# EAGLE design Module-Extension_V101 (EAGLE 6.4)

## Sheet 1 of 2
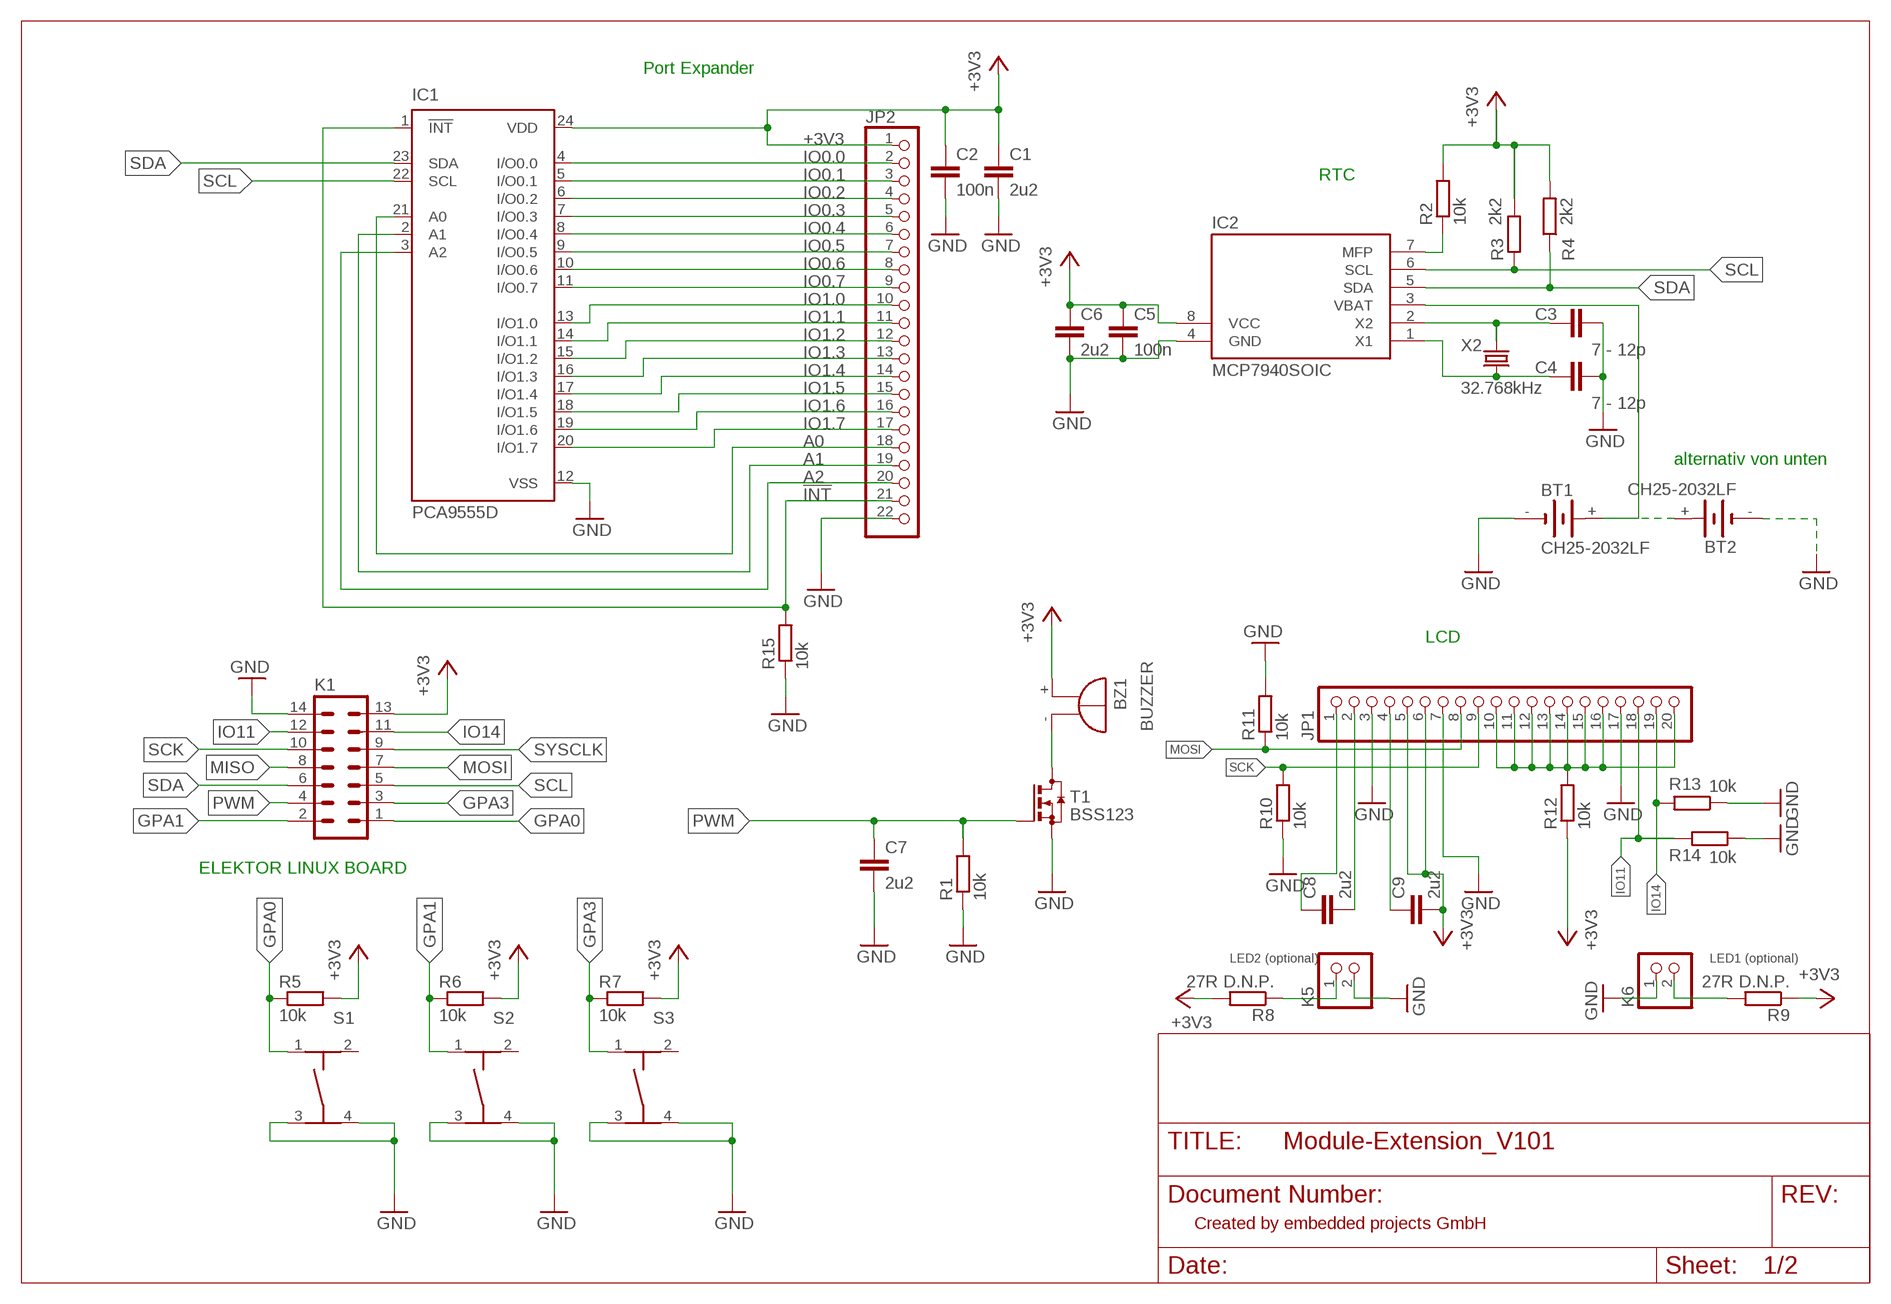
[diagram p0: schematic, sheet 1]

### Parts
BT1  CH25-2032LF  [CH25]
BT2  CH25-2032LF  [CH25]
BZ1  BUZZER  F/TMB  [F/TMB]
C1  2u2  C-EUC0805  [C0805]
C2  100n  C-EUC0805  [C0805]
C3  7 - 12p  C-EUC0805  [C0805]
C4  7 - 12p  C-EUC0805  [C0805]
C5  100n  C-EUC0805  [C0805]
C6  2u2  C-EUC0805  [C0805]
C7  2u2  C-EUC0805  [C0805]
C8  2u2  C-EUC0805  [C0805]
C9  2u2  C-EUC0805  [C0805]
IC1  PCA9555D  [SO24]
IC2  MCP7940SOIC  [SOIC-8]
JP1  PINHD-1X20  [1X20]
JP2  PINHD-1X22  [1X22]
K1  ML14  [ML14]
K5  PINHD-1X2  [1X02]
K6  PINHD-1X2  [1X02]
R1  10k  R-EU_R0805  [R0805]
R2  10k  R-EU_R0805  [R0805]
R3  2k2  R-EU_R0805  [R0805]
R4  2k2  R-EU_R0805  [R0805]
R5  10k  R-EU_R0805  [R0805]
R6  10k  R-EU_R0805  [R0805]
R7  10k  R-EU_R0805  [R0805]
R8  27R D.N.P.  R-EU_R0805  [R0805]
R9  27R D.N.P.  R-EU_R0805  [R0805]
R10  10k  R-EU_R0805  [R0805]
R11  10k  R-EU_R0805  [R0805]
R12  10k  R-EU_R0805  [R0805]
R13  10k  R-EU_R0805  [R0805]
R14  10k  R-EU_R0805  [R0805]
R15  10k  R-EU_R0805  [R0805]
S1  ERGAENZUNG_TASTER-9314_SMD  [ERGAENZUNG_TASTER-9314_SMD]
S2  ERGAENZUNG_TASTER-9314_SMD  [ERGAENZUNG_TASTER-9314_SMD]
S3  ERGAENZUNG_TASTER-9314_SMD  [ERGAENZUNG_TASTER-9314_SMD]
T1  BSS123  [SOT23]
X2  32.768kHz  CRYSTALTC26H  [TC26H]

### Nets
!INT: IC1.1(!INT) JP2.21 R15.2
+3V3: BZ1.+ C1.1 C2.1 C5.1 C6.1 C9.2 IC1.24(VDD) IC2.8(VCC) JP1.5 JP1.6 JP2.1 K1.13 R2.2 R3.2 R4.2 R5.2 R6.2 R7.2 R8.2 R9.1 R12.1 ; also sheet 2
A0: IC1.21(A0) JP2.18
A1: IC1.2(A1) JP2.19
A2: IC1.3(A2) JP2.20
GND: BT1.- BT2.- C1.2 C2.2 C3.2 C4.2 C5.2 C6.2 C7.2 IC1.12(VSS) IC2.4(GND) JP1.3 JP1.7 JP1.17 JP2.22 K1.14 K5.2 K6.1 R1.1 R10.1 R11.2 R13.1 R14.1 R15.1 S1.3 S1.4 S2.3 S2.4 S3.3 S3.4 T1.2(S) ; also sheet 2
GPA0: K1.1 R5.1 S1.1
GPA1: K1.2 R6.1 S2.1
GPA3: K1.3 R7.1 S3.1
IO0.0: IC1.4(I/O0.0) JP2.2
IO0.1: IC1.5(I/O0.1) JP2.3
IO0.2: IC1.6(I/O0.2) JP2.4
IO0.3: IC1.7(I/O0.3) JP2.5
IO0.4: IC1.8(I/O0.4) JP2.6
IO0.5: IC1.9(I/O0.5) JP2.7
IO0.6: IC1.10(I/O0.6) JP2.8
IO0.7: IC1.11(I/O0.7) JP2.9
IO1.0: IC1.13(I/O1.0) JP2.10
IO1.1: IC1.14(I/O1.1) JP2.11
IO1.2: IC1.15(I/O1.2) JP2.12
IO1.3: IC1.16(I/O1.3) JP2.13
IO1.4: IC1.17(I/O1.4) JP2.14
IO1.5: IC1.18(I/O1.5) JP2.15
IO1.6: IC1.19(I/O1.6) JP2.16
IO1.7: IC1.20(I/O1.7) JP2.17
IO11: JP1.18 K1.12 R14.2
IO14: JP1.19 K1.11 R13.2
MISO: K1.8
MOSI: JP1.8 K1.7 R11.1
N$1: C8.1 JP1.1
N$2: BZ1.- T1.3(D)
N$3: IC2.7(MFP) R2.1
N$4: C3.1 IC2.2(X2) X2.1
N$5: C8.2 JP1.2
N$6: C9.1 JP1.4
N$7: K5.1 R8.1
N$8: K6.2 R9.2
N$9: JP1.10 JP1.11 JP1.12 JP1.13 JP1.14 JP1.15 JP1.16 JP1.20 R12.2
N$11: C4.1 IC2.1(X1) X2.2
PWM: C7.1 K1.4 R1.2 T1.1(G)
SCK: JP1.9 K1.10 R10.2
SCL: IC1.22(SCL) IC2.6(SCL) K1.5 R3.1
SDA: IC1.23(SDA) IC2.5(SDA) K1.6 R4.1
SYSCLK: K1.9
VBAT: BT1.+ BT2.+ IC2.3(VBAT)
Unconnected: S1.2 S2.2 S3.2

### Notes on the sheet
- Port Expander
- RTC
- alternativ von unten
- LCD
- ELEKTOR LINUX BOARD
- LED2 (optional) | LED1 (optional)
- Created by embedded projects GmbH

## Sheet 2 of 2
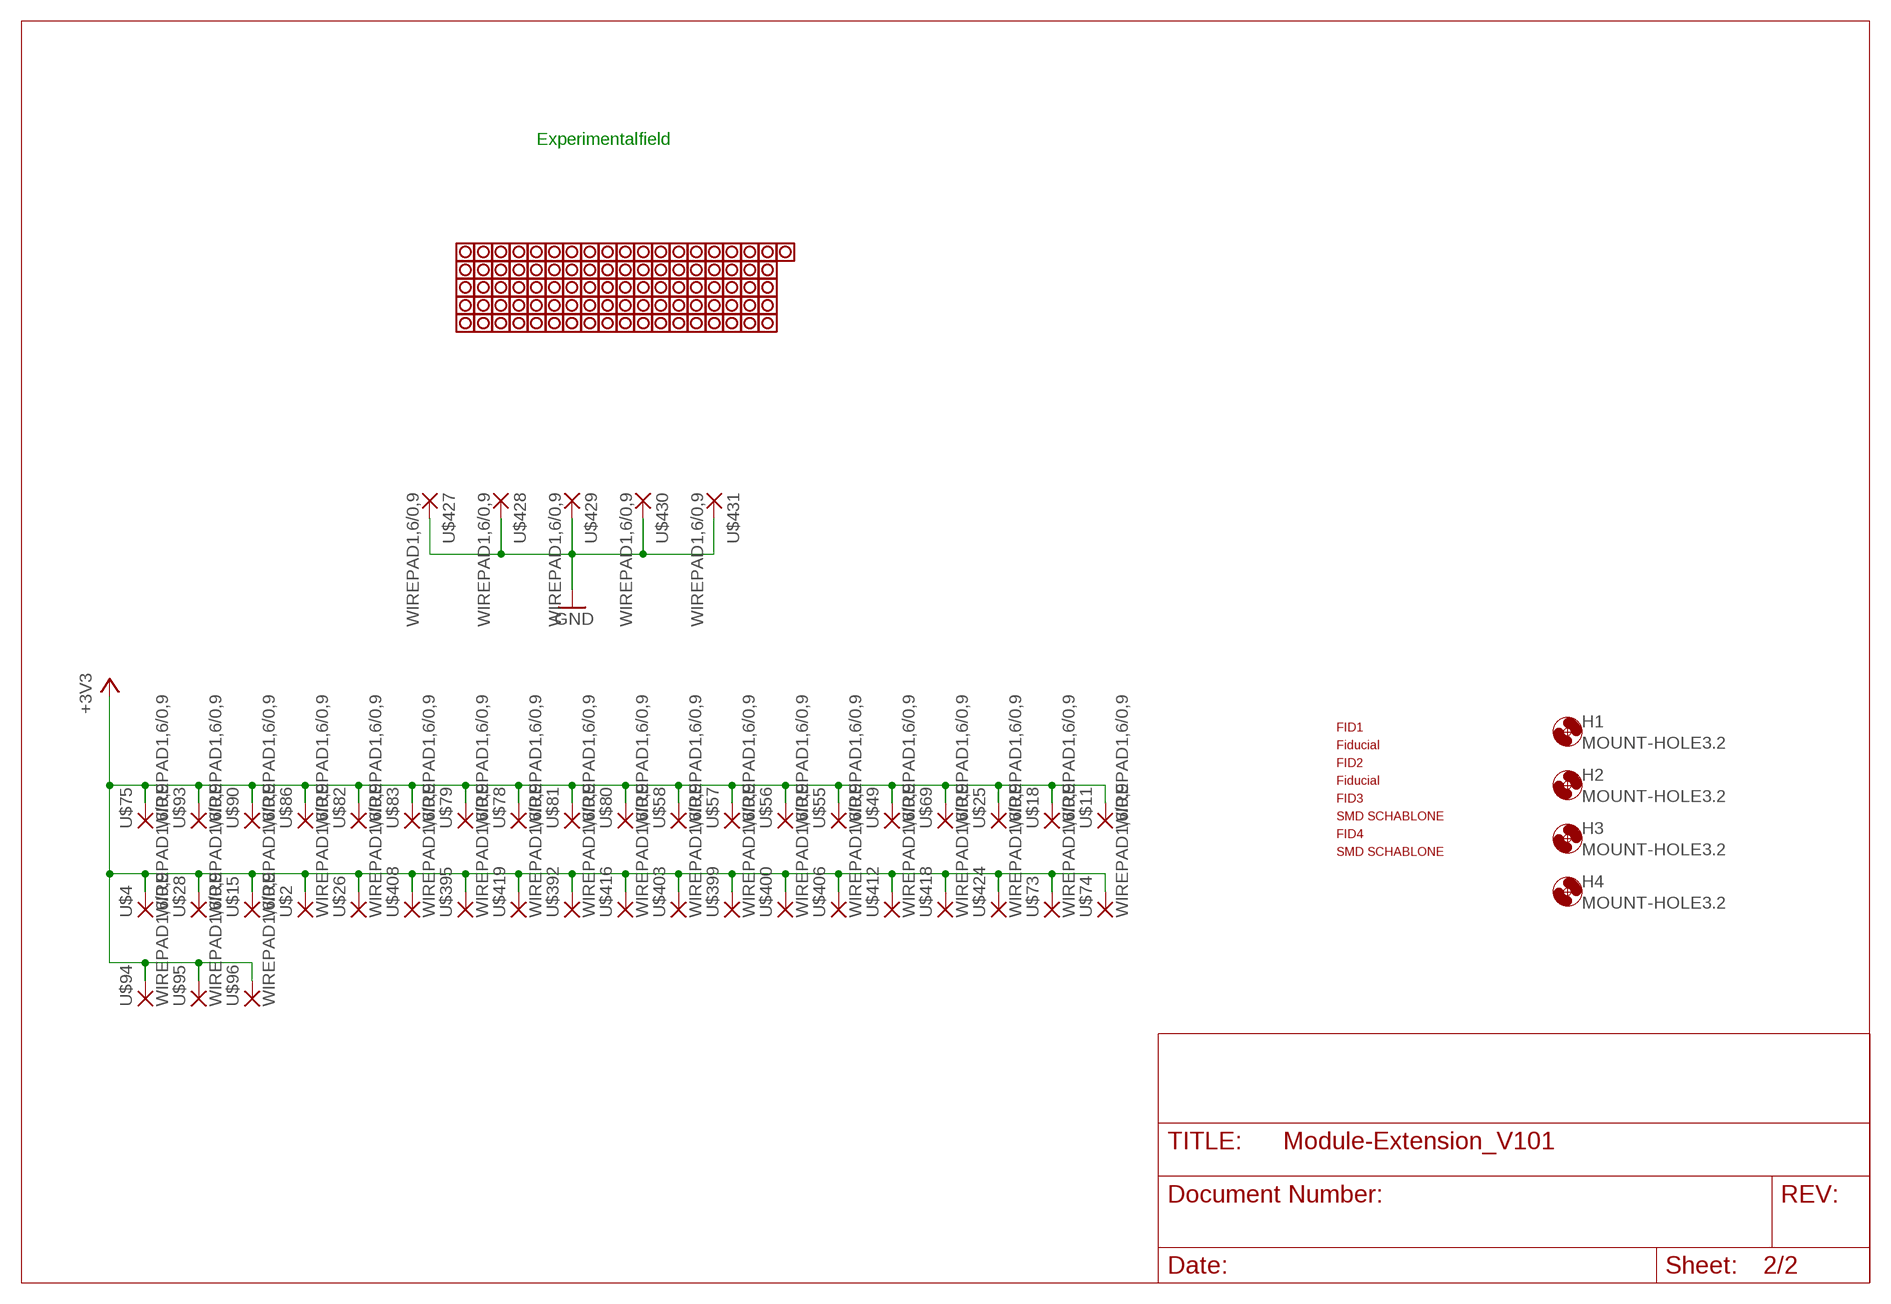
[diagram p1: schematic, sheet 2]

### Parts
FID1  PASSERMARKEN_FIDUCIAL  [PASSERMARKEN_FIDUCIAL]
FID2  PASSERMARKEN_FIDUCIAL  [PASSERMARKEN_FIDUCIAL]
FID3  PASSERMARKEN_FIDUCIAL  [PASSERMARKEN_FIDUCIAL]
FID4  PASSERMARKEN_FIDUCIAL  [PASSERMARKEN_FIDUCIAL]
H1  MOUNT-HOLE3.2  [3,2]
H2  MOUNT-HOLE3.2  [3,2]
H3  MOUNT-HOLE3.2  [3,2]
H4  MOUNT-HOLE3.2  [3,2]
U$2  WIREPAD1,6/0,9  [1,6/0,9]
U$3  VIAS  [VIAS]
U$4  WIREPAD1,6/0,9  [1,6/0,9]
U$5  VIAS  [VIAS]
U$6  VIAS  [VIAS]
U$7  VIAS  [VIAS]
U$8  VIAS  [VIAS]
U$9  VIAS  [VIAS]
U$10  VIAS  [VIAS]
U$11  WIREPAD1,6/0,9  [1,6/0,9]
U$12  VIAS  [VIAS]
U$13  VIAS  [VIAS]
U$14  VIAS  [VIAS]
U$15  WIREPAD1,6/0,9  [1,6/0,9]
U$16  VIAS  [VIAS]
U$17  VIAS  [VIAS]
U$18  WIREPAD1,6/0,9  [1,6/0,9]
U$19  VIAS  [VIAS]
U$20  VIAS  [VIAS]
U$21  VIAS  [VIAS]
U$22  VIAS  [VIAS]
U$23  VIAS  [VIAS]
U$24  VIAS  [VIAS]
U$25  WIREPAD1,6/0,9  [1,6/0,9]
U$26  WIREPAD1,6/0,9  [1,6/0,9]
U$27  VIAS  [VIAS]
U$28  WIREPAD1,6/0,9  [1,6/0,9]
U$29  VIAS  [VIAS]
U$30  VIAS  [VIAS]
U$31  VIAS  [VIAS]
U$32  VIAS  [VIAS]
U$33  VIAS  [VIAS]
U$34  VIAS  [VIAS]
U$35  VIAS  [VIAS]
U$36  VIAS  [VIAS]
U$37  VIAS  [VIAS]
U$38  VIAS  [VIAS]
U$39  VIAS  [VIAS]
U$40  VIAS  [VIAS]
U$41  VIAS  [VIAS]
U$42  VIAS  [VIAS]
U$43  VIAS  [VIAS]
U$44  VIAS  [VIAS]
U$45  VIAS  [VIAS]
U$46  VIAS  [VIAS]
U$47  VIAS  [VIAS]
U$48  VIAS  [VIAS]
U$49  WIREPAD1,6/0,9  [1,6/0,9]
U$50  VIAS  [VIAS]
U$51  VIAS  [VIAS]
U$52  VIAS  [VIAS]
U$53  VIAS  [VIAS]
U$54  VIAS  [VIAS]
U$55  WIREPAD1,6/0,9  [1,6/0,9]
U$56  WIREPAD1,6/0,9  [1,6/0,9]
U$57  WIREPAD1,6/0,9  [1,6/0,9]
U$58  WIREPAD1,6/0,9  [1,6/0,9]
U$59  VIAS  [VIAS]
U$60  VIAS  [VIAS]
U$61  VIAS  [VIAS]
U$62  VIAS  [VIAS]
U$63  VIAS  [VIAS]
U$64  VIAS  [VIAS]
U$65  VIAS  [VIAS]
U$66  VIAS  [VIAS]
U$67  VIAS  [VIAS]
U$68  VIAS  [VIAS]
U$69  WIREPAD1,6/0,9  [1,6/0,9]
U$70  VIAS  [VIAS]
U$71  VIAS  [VIAS]
U$72  VIAS  [VIAS]
U$73  WIREPAD1,6/0,9  [1,6/0,9]
U$74  WIREPAD1,6/0,9  [1,6/0,9]
U$75  WIREPAD1,6/0,9  [1,6/0,9]
U$76  VIAS  [VIAS]
U$77  VIAS  [VIAS]
U$78  WIREPAD1,6/0,9  [1,6/0,9]
U$79  WIREPAD1,6/0,9  [1,6/0,9]
U$80  WIREPAD1,6/0,9  [1,6/0,9]
U$81  WIREPAD1,6/0,9  [1,6/0,9]
U$82  WIREPAD1,6/0,9  [1,6/0,9]
U$83  WIREPAD1,6/0,9  [1,6/0,9]
U$84  VIAS  [VIAS]
U$85  VIAS  [VIAS]
U$86  WIREPAD1,6/0,9  [1,6/0,9]
U$87  VIAS  [VIAS]
U$88  VIAS  [VIAS]
U$89  VIAS  [VIAS]
U$90  WIREPAD1,6/0,9  [1,6/0,9]
U$91  VIAS  [VIAS]
U$92  VIAS  [VIAS]
U$93  WIREPAD1,6/0,9  [1,6/0,9]
U$94  WIREPAD1,6/0,9  [1,6/0,9]
U$95  WIREPAD1,6/0,9  [1,6/0,9]
U$96  WIREPAD1,6/0,9  [1,6/0,9]
U$391  VIAS  [VIAS]
U$392  WIREPAD1,6/0,9  [1,6/0,9]
U$393  VIAS  [VIAS]
U$394  VIAS  [VIAS]
U$395  WIREPAD1,6/0,9  [1,6/0,9]
U$396  VIAS  [VIAS]
U$397  VIAS  [VIAS]
U$398  VIAS  [VIAS]
U$399  WIREPAD1,6/0,9  [1,6/0,9]
U$400  WIREPAD1,6/0,9  [1,6/0,9]
U$401  VIAS  [VIAS]
U$402  VIAS  [VIAS]
U$403  WIREPAD1,6/0,9  [1,6/0,9]
U$404  VIAS  [VIAS]
U$405  VIAS  [VIAS]
U$406  WIREPAD1,6/0,9  [1,6/0,9]
U$407  VIAS  [VIAS]
U$408  WIREPAD1,6/0,9  [1,6/0,9]
U$409  VIAS  [VIAS]
U$410  VIAS  [VIAS]
U$411  VIAS  [VIAS]
U$412  WIREPAD1,6/0,9  [1,6/0,9]
U$413  VIAS  [VIAS]
U$414  VIAS  [VIAS]
U$415  VIAS  [VIAS]
U$416  WIREPAD1,6/0,9  [1,6/0,9]
U$417  VIAS  [VIAS]
U$418  WIREPAD1,6/0,9  [1,6/0,9]
U$419  WIREPAD1,6/0,9  [1,6/0,9]
U$420  VIAS  [VIAS]
U$421  VIAS  [VIAS]
U$422  VIAS  [VIAS]
U$423  VIAS  [VIAS]
U$424  WIREPAD1,6/0,9  [1,6/0,9]
U$425  VIAS  [VIAS]
U$426  VIAS  [VIAS]
U$427  WIREPAD1,6/0,9  [1,6/0,9]
U$428  WIREPAD1,6/0,9  [1,6/0,9]
U$429  WIREPAD1,6/0,9  [1,6/0,9]
U$430  WIREPAD1,6/0,9  [1,6/0,9]
U$431  WIREPAD1,6/0,9  [1,6/0,9]
U$432  VIAS  [VIAS]

### Nets
+3V3: U$2.1(P) U$4.1(P) U$11.1(P) U$15.1(P) U$18.1(P) U$25.1(P) U$26.1(P) U$28.1(P) U$49.1(P) U$55.1(P) U$56.1(P) U$57.1(P) U$58.1(P) U$69.1(P) U$73.1(P) U$74.1(P) U$75.1(P) U$78.1(P) U$79.1(P) U$80.1(P) U$81.1(P) U$82.1(P) U$83.1(P) U$86.1(P) U$90.1(P) U$93.1(P) U$94.1(P) U$95.1(P) U$96.1(P) U$392.1(P) U$395.1(P) U$399.1(P) U$400.1(P) U$403.1(P) U$406.1(P) U$408.1(P) U$412.1(P) U$416.1(P) U$418.1(P) U$419.1(P) U$424.1(P) ; also sheet 1
GND: U$427.1(P) U$428.1(P) U$429.1(P) U$430.1(P) U$431.1(P) ; also sheet 1

### Notes on the sheet
- Experimentalfield

## Library data of the parts
BT1 BT2 = Batteriehalter:CH25-2032LF; FARNELL: 2064715
BZ1 = buzzer:F/TMB: BUZZER Source: Buerklin; OC_FARNELL: unknown; OC_NEWARK: unknown
C1-C9 = rcl:C-EU: CAPACITOR, European symbol
FID1 FID2 = KUBUS3:PASSERMARKEN_FIDUCIAL: SMD Passermarke
FID3 FID4 = SMDSCHABLONE:PASSERMARKEN_FIDUCIAL: SMD Passermarke
H1-H4 = holes:MOUNT-HOLE: MOUNTING HOLE with drill center marker
IC1 = micro-philips:PCA9555: 16-bit I2C and SMBus I/O port with interrupt Source: PCA9555_5.pdf; MPN: PCA9555DW; OC_FARNELL: 8906076; OC_NEWARK: 63K6067
IC2 = mcp7940:MCP7940: I²C Real-Time Clock/Calendar
JP1 = pinhead:PINHD-1X20: PIN HEADER
JP2 = pinhead:PINHD-1X22: PIN HEADER
K1 = con-ml:ML14: HARTING; OC_FARNELL: unknown; OC_NEWARK: unknown
K5 K6 = pinhead:PINHD-1X2: PIN HEADER
R1-R15 = rcl:R-EU_: RESISTOR, European symbol
S1-S3 = OPENKUBUSRTC:ERGAENZUNG_TASTER-9314_SMD
T1 = transistor-small-signal:BSS123: N-CHANNEL MOS FET
U$2 U$4 U$11 U$15 U$18 U$25 U$26 U$28 U$49 U$55-U$58 U$69 U$73-U$75 U$78-U$83 U$86 U$90 U$93-U$96 U$392 U$395 U$399 U$400 U$403 U$406 U$408 U$412 U$416 U$418 U$419 U$424 U$427-U$431 = wirepad:WIREPAD: Wire PAD connect wire on PCB
U$3 U$5-U$10 U$12-U$14 U$16 U$17 U$19-U$24 U$27 U$29-U$48 U$50-U$54 U$59-U$68 U$70-U$72 U$76 U$77 U$84 U$85 U$87-U$89 U$91 U$92 U$391 U$393 U$394 U$396-U$398 U$401 U$402 U$404 U$405 U$407 U$409-U$411 U$413-U$415 U$417 U$420-U$423 U$425 U$426 U$432 = VIAS:VIAS
X2 = crystal:CRYSTAL: CRYSTAL; OC_FARNELL: unknown; OC_NEWARK: unknown

## Board
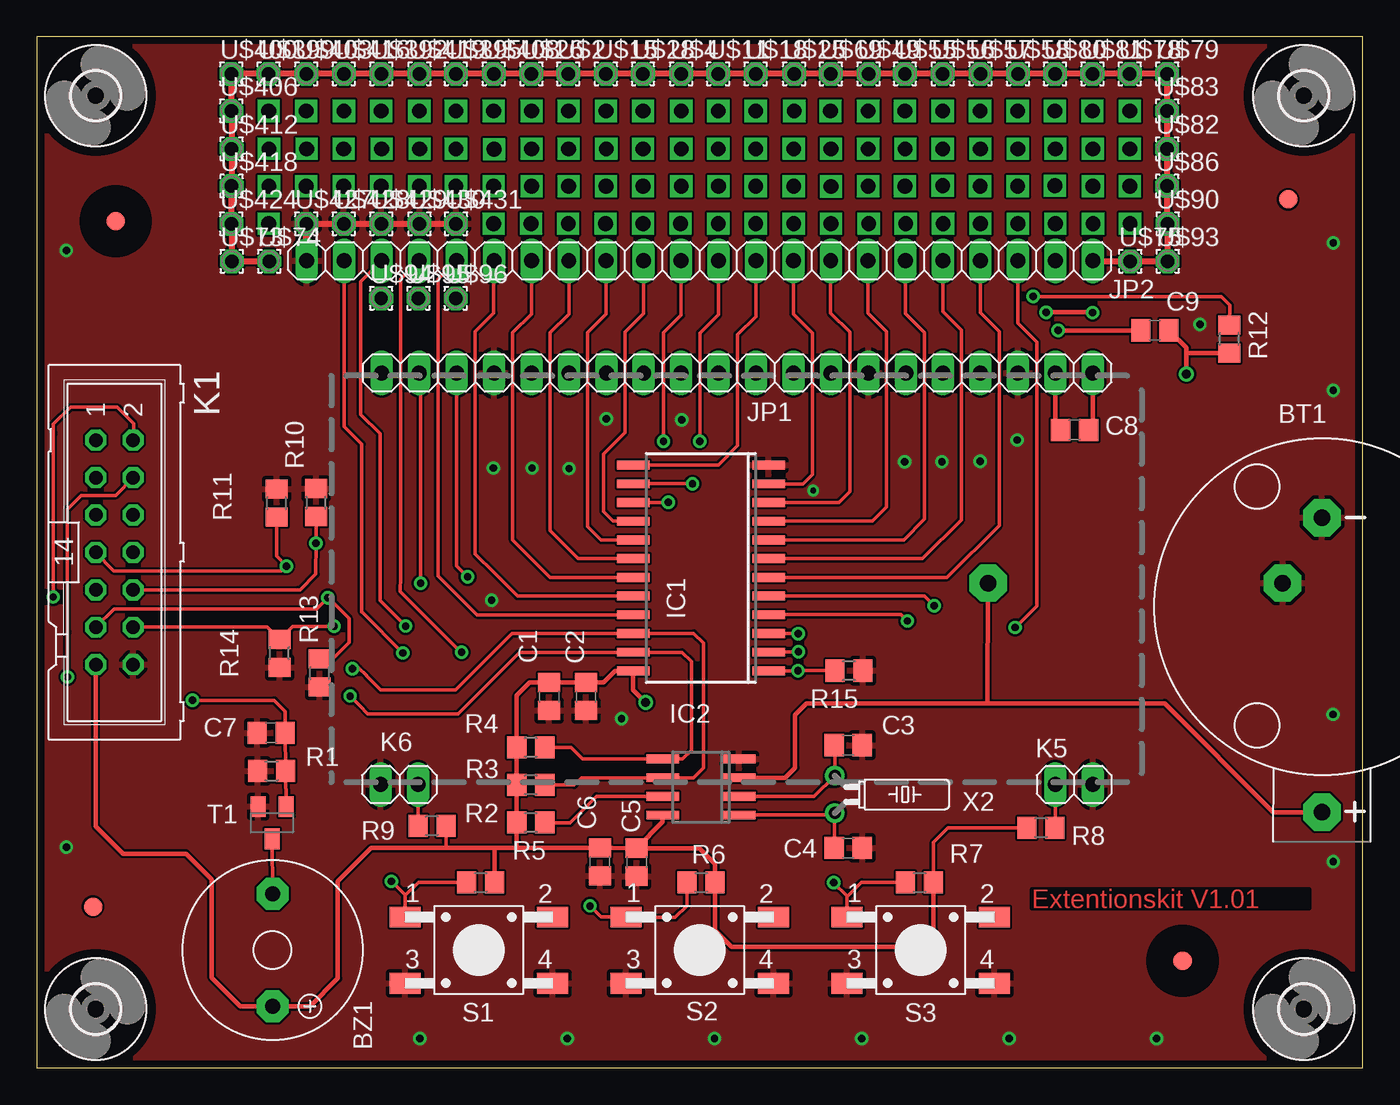
[diagram p2: board, top side]
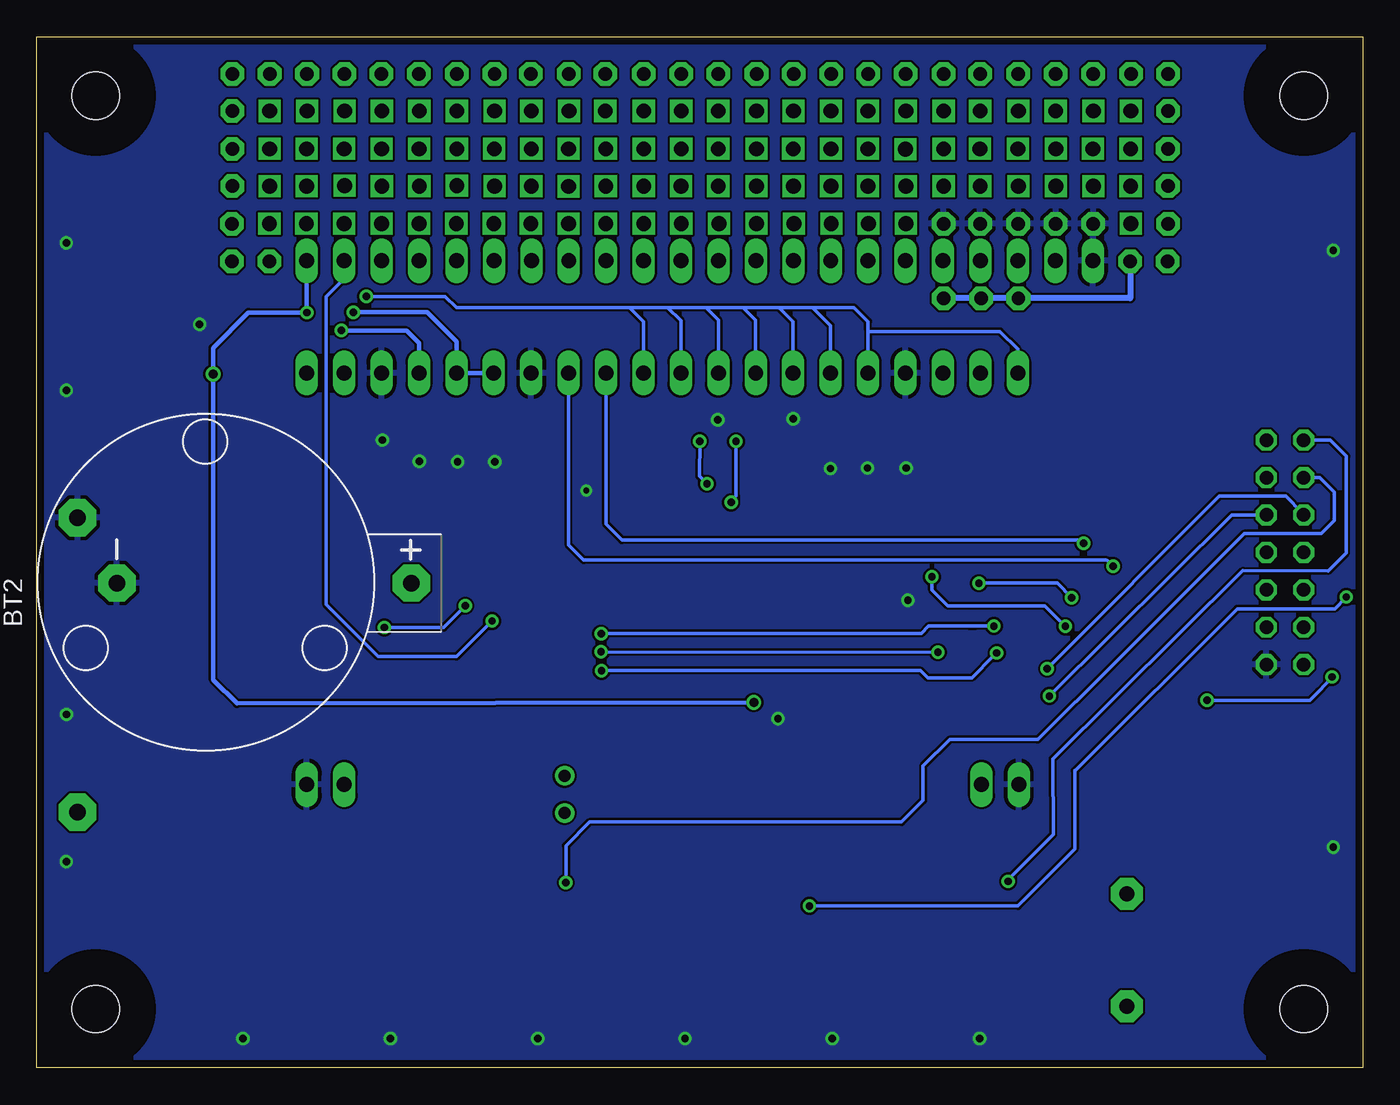
[diagram p3: board, bottom side, seen from below]

Size 90 x 70 mm. Coordinates in mm from the lower left corner, seen from the top.
Outline: 0,0 90,0 90,70 0,70 0,0
Copper layers (1*16): Top 0.035mm / dielectric 1.5mm / Bottom 0.035mm
Design rules "default *": minimum track width 6mil, minimum drill 20mil, track to track 6mil, track to pad 6mil, pad to pad 8mil, via to via 8mil, smd to smd 8mil, copper to edge 20mil, drill to drill 8mil, minimum pad ring 10mil, minimum via ring 8mil, stop-mask expansion 2mil, vias tented up to drill 40mil, thermal gap 10mil

### Footprints (pad centres in the part's own frame; a part is rotated, then mirrored left to right if it is on the bottom)
CH25 = drill 1.118 pad 2.54 octagon: + 0,-14; - 0,6
F/TMB = drill 1.016 pad 2.159 octagon: + 3.81,0; - -3.81,0
C0805 = smd 1.3 x 1.5: 1 -0.95,0; 2 0.95,0
PASSERMARKEN_FIDUCIAL = smd 1.27 x 1.27: 1 0,0
3,2 = hole 3.2: 0,0
SO24 = smd 0.6 x 2.2: 1 -6.985,-4.6; 2 -5.715,-4.6; 3 -4.445,-4.6; 4 -3.175,-4.6; 5 -1.905,-4.6; 6 -0.635,-4.6; 7 0.635,-4.6; 8 1.905,-4.6; 9 3.175,-4.6; 10 4.445,-4.6; 11 5.715,-4.6; 12 6.985,-4.6; 13 6.985,4.6; 14 5.715,4.6; 15 4.445,4.6; 16 3.175,4.6; 17 1.905,4.6; 18 0.635,4.6; 19 -0.635,4.6; 20 -1.905,4.6; 21 -3.175,4.6; 22 -4.445,4.6; 23 -5.715,4.6; 24 -6.985,4.6
SOIC-8 = smd 0.6 x 2.2: 1 -1.905,-2.6; 2 -0.635,-2.6; 3 0.635,-2.6; 4 1.905,-2.6; 5 1.905,2.6; 6 0.635,2.6; 7 -0.635,2.6; 8 -1.905,2.6
1X20 = drill 1.016 long: 1 -24.13,0; 2 -21.59,0; 3 -19.05,0; 4 -16.51,0; 5 -13.97,0; 6 -11.43,0; 7 -8.89,0; 8 -6.35,0; 9 -3.81,0; 10 -1.27,0; 11 1.27,0; 12 3.81,0; 13 6.35,0; 14 8.89,0; 15 11.43,0; 16 13.97,0; 17 16.51,0; 18 19.05,0; 19 21.59,0; 20 24.13,0
1X22 = drill 1.016 long: 1 -26.67,0; 2 -24.13,0; 3 -21.59,0; 4 -19.05,0; 5 -16.51,0; 6 -13.97,0; 7 -11.43,0; 8 -8.89,0; 9 -6.35,0; 10 -3.81,0; 11 -1.27,0; 12 1.27,0; 13 3.81,0; 14 6.35,0; 15 8.89,0; 16 11.43,0; 17 13.97,0; 18 16.51,0; 19 19.05,0; 20 21.59,0; 21 24.13,0; 22 26.67,0
ML14 = drill 0.914 octagon: 1 -7.62,-1.27; 2 -7.62,1.27; 3 -5.08,-1.27; 4 -5.08,1.27; 5 -2.54,-1.27; 6 -2.54,1.27; 7 0,-1.27; 8 0,1.27; 9 2.54,-1.27; 10 2.54,1.27; 11 5.08,-1.27; 12 5.08,1.27; 13 7.62,-1.27; 14 7.62,1.27
1X02 = drill 1.016 long: 1 -1.27,0; 2 1.27,0
R0805 = smd 1.3 x 1.5: 1 -0.95,0; 2 0.95,0
ERGAENZUNG_TASTER-9314_SMD = smd 2.1 x 1.4: 1 -5,2.25; 2 5,2.25; 3 -5,-2.25; 4 5,-2.25
SOT23 = smd 1 x 1.4: 1 -0.95,-1.1; 2 0.95,-1.1; 3 0,1.1
1,6/0,9 = drill 0.914 pad 1.6 octagon: 1 0,0
VIAS = drill 1 square: P$1 0,0
TC26H = drill 0.813: 1 -1.27,0; 2 1.27,0

### Placement (x,y rotation side)
BT1  87.23,31.36 0 top
BT2  78.57,32.92 90 bottom
BZ1  16,8 270 top
C1  34.78,25.21 270 top
C2  37.28,25.21 270 top
C3  55.08,21.91 0 top
C4  55.08,14.93 0 top
C5  40.71,13.97 270 top
C6  38.22,13.99 270 top
C7  15.9,22.75 180 top
C8  70.45,43.31 180 top
C9  75.89,50.07 0 top
FID1  77.77,7.28 0 top
FID2  5.35,57.5 270 top
FID3  3.82,10.95 0 top
FID4  84.95,58.97 0 top
H1  4,66 0 top
H2  4,4 0 top
H3  86,66 0 top
H4  86,4 0 top
IC1  45.08,33.94 90 top
IC2  45.08,19.07 90 top
JP1  47.55,47.18 180 top
JP2  45,54.8 180 top
K1  5.27,35 270 top
K5  70.41,19.24 0 top
K6  24.61,19.24 0 top
R1  15.94,20.16 0 top
R2  33.53,16.66 180 top
R3  33.53,19.21 180 top
R4  33.53,21.76 180 top
R5  30.13,12.6 0 top
R6  45.09,12.6 0 top
R7  59.92,12.6 0 top
R8  68.16,16.3 180 top
R9  26.82,16.44 180 top
R10  18.95,38.38 270 top
R11  16.28,38.34 90 top
R12  80.95,49.49 90 top
R13  19.19,26.81 90 top
R14  16.47,28.15 90 top
R15  55.13,26.97 180 top
S1  30,8 0 top
S2  45,8 0 top
S3  60,8 0 top
T1  15.97,16.65 180 top
U$2  36.07,67.49 0 top
U$3  41.15,64.97 0 top
U$4  43.74,67.49 0 top
U$5  48.79,64.97 0 top
U$6  51.38,62.4 0 top
U$7  53.87,64.97 0 top
U$8  36.09,64.97 0 top
U$9  41.15,62.4 0 top
U$10  43.74,64.97 0 top
U$11  46.25,67.49 0 top
U$12  51.38,59.87 0 top
U$13  53.9,62.4 0 top
U$14  36.09,62.4 0 top
U$15  38.63,67.49 0 top
U$16  43.74,62.4 0 top
U$17  46.25,64.97 0 top
U$18  48.79,67.49 0 top
U$19  53.9,59.85 0 top
U$20  36.09,59.87 0 top
U$21  38.63,64.97 0 top
U$22  43.74,59.87 0 top
U$23  46.25,62.4 0 top
U$24  48.79,62.4 0 top
U$25  51.41,67.49 0 top
U$26  33.58,67.49 0 top
U$27  38.66,62.4 0 top
U$28  41.15,67.49 0 top
U$29  46.28,59.87 0 top
U$30  48.79,59.87 0 top
U$31  51.41,64.97 0 top
U$32  33.58,64.97 0 top
U$33  38.63,59.87 0 top
U$34  41.15,59.87 0 top
U$35  46.25,57.31 0 top
U$36  48.79,57.31 0 top
U$37  53.9,57.31 0 top
U$38  33.55,57.31 0 top
U$39  36.07,57.31 0 top
U$40  38.61,57.31 0 top
U$41  41.15,57.31 0 top
U$42  43.69,57.31 0 top
U$43  51.38,57.31 0 top
U$44  58.93,59.87 0 top
U$45  61.49,62.4 0 top
U$46  64.06,62.4 0 top
U$47  66.6,62.4 0 top
U$48  69.14,62.4 0 top
U$49  56.46,67.49 0 top
U$50  61.49,59.9 0 top
U$51  64.03,59.87 0 top
U$52  66.57,59.87 0 top
U$53  69.11,59.9 0 top
U$54  56.44,64.97 0 top
U$55  58.93,67.49 0 top
U$56  61.49,67.49 0 top
U$57  64.06,67.49 0 top
U$58  66.6,67.49 0 top
U$59  56.44,62.4 0 top
U$60  58.93,64.97 0 top
U$61  61.49,64.97 0 top
U$62  64.03,64.97 0 top
U$63  66.57,64.97 0 top
U$64  56.44,59.87 0 top
U$65  58.95,62.4 0 top
U$66  61.52,57.31 0 top
U$67  64.06,57.31 0 top
U$68  66.6,57.31 0 top
U$69  53.9,67.49 0 top
U$70  56.46,57.31 0 top
U$71  58.98,57.31 0 top
U$72  71.68,62.4 0 top
U$73  13.23,54.76 0 top
U$74  15.77,54.76 0 top
U$75  74.22,54.76 0 top
U$76  71.68,59.87 0 top
U$77  74.19,64.97 0 top
U$78  74.19,67.49 0 top
U$79  76.73,67.49 0 top
U$80  69.11,67.49 0 top
U$81  71.65,67.49 0 top
U$82  76.73,62.4 0 top
U$83  76.73,64.97 0 top
U$84  69.11,64.97 0 top
U$85  71.65,64.97 0 top
U$86  76.73,59.87 0 top
U$87  74.19,62.4 0 top
U$88  71.7,57.31 0 top
U$89  74.22,57.31 0 top
U$90  76.76,57.31 0 top
U$91  74.19,59.87 0 top
U$92  69.14,57.31 0 top
U$93  76.76,54.76 0 top
U$94  23.37,52.25 0 top
U$95  25.91,52.25 0 top
U$96  28.44,52.25 0 top
U$391  20.83,62.4 0 top
U$392  23.38,67.49 0 top
U$393  25.97,59.87 0 top
U$394  25.98,62.4 0 top
U$395  28.44,67.49 0 top
U$396  33.58,62.4 0 top
U$397  20.83,59.87 0 top
U$398  23.38,64.97 0 top
U$399  15.73,67.49 0 top
U$400  13.2,67.49 0 top
U$401  28.44,64.97 0 top
U$402  33.58,59.87 0 top
U$403  18.29,67.49 0 top
U$404  23.4,62.4 0 top
U$405  15.73,64.97 0 top
U$406  13.2,64.97 0 top
U$407  28.44,62.4 0 top
U$408  31.01,67.49 0 top
U$409  18.29,64.97 0 top
U$410  23.38,59.87 0 top
U$411  15.76,62.4 0 top
U$412  13.22,62.4 0 top
U$413  28.44,59.87 0 top
U$414  31.01,64.97 0 top
U$415  18.31,62.4 0 top
U$416  20.84,67.49 0 top
U$417  15.76,59.87 0 top
U$418  13.22,59.87 0 top
U$419  25.97,67.49 0 top
U$420  31.04,62.37 0 top
U$421  18.29,59.87 0 top
U$422  20.84,64.97 0 top
U$423  15.73,57.31 0 top
U$424  13.2,57.31 0 top
U$425  25.97,64.97 0 top
U$426  31.01,59.87 0 top
U$427  18.29,57.31 0 top
U$428  20.84,57.31 0 top
U$429  23.38,57.31 0 top
U$430  25.98,57.31 0 top
U$431  28.46,57.31 0 top
U$432  31.01,57.31 0 top
X2  54.17,18.57 270 top

### Tracks (layer width: path | path; a pad name or v marks a point on that pad's centre or on a via)
!INT  (via drill 0.5)
  Top 0.254: IC1.1 v51.67,26.96 51.67,26.98 R15.2 | v24.84,28.17 22.1,30.91 22.05,30.97 22.05,42.35 20.87,43.54 JP2.21
  Bottom 0.254: v51.67,26.96 51.63,26.97 30.02,26.98 29.52,26.48 26.54,26.49 25.06,27.97 v24.84,28.17
+3V3  (via drill 0.5, 0.6)
  Top 0.254: R8.2 61.86,16.3 60.87,15.31 R7.2 | R9.1 27.77,14.95 27.76,14.94
  Top 0.305: K1.13 4,16.41 5.86,14.54 10.13,14.54 11.87,12.8 11.87,6.12 13.8,4.19 BZ1.+ 18.54,4.19 20.43,6.08 20.43,12.67 22.7,14.94 27.76,14.94 31.11,14.94 | C5.1 39.04,14.94 C6.1 32.61,14.94 | R5.2 31.08,14.91 31.11,14.94 | IC2.8 42.48,16.69 C5.1 | 31.11,14.94 32.61,14.94 | 32.61,14.94 32.58,14.97 32.58,15.38 R2.2 R3.2 R4.2 32.58,25.28 33.46,26.16 C1.1 C2.1 38.48,26.17 39.27,26.95 IC1.24 40.48,25.66 v41.33,24.81 | R7.2 60.87,9.39 59.69,8.21 47.17,8.21 46.04,9.34 R6.2 46.03,13.86 44.99,14.9 41.08,14.9 C5.1 | v78.04,47.1 78.04,48.38 | 78.04,48.38 78.04,48.9 C9.2 | R12.1 78.2,48.54 78.04,48.38 | v68.52,51.3 71.65,51.3 v71.67,51.28
  Top 0.406: JP2.1 71.67,54.76 U$75.1 U$93.1 U$90.1 76.73,57.31 U$86.1 U$82.1 U$83.1 U$79.1 U$78.1 U$81.1 U$80.1 U$58.1 U$57.1 U$56.1 U$55.1 U$49.1 U$69.1 U$25.1 U$18.1 U$11.1 U$4.1 U$28.1 U$15.1 U$2.1 U$26.1 U$408.1 U$395.1 U$419.1 U$392.1 U$416.1 U$403.1 U$399.1 U$400.1 U$406.1 13.22,64.97 U$412.1 U$418.1 13.2,59.87 U$424.1 13.23,57.31 U$73.1 U$74.1
  Bottom 0.305: v41.33,24.81 76.41,24.74 78.02,26.35 78.02,47.08 v78.04,47.1 | v78.04,47.1 v78.03,47.11 | JP1.6 JP1.5 61.52,49.31 63.51,51.31 68.37,51.31 v68.52,51.3 | JP2.1 v71.67,51.28 75.65,51.28 78.03,48.88 v78.03,47.09 v78.04,47.1
  Bottom 0.406: U$96.1 U$95.1 U$94.1 15.77,52.25 U$74.1
A0
  Top 0.254: IC1.21 29.89,30.77 28.56,32.09 27.24,33.41 27.24,53.56 JP2.18
A1  (via drill 0.5)
  Top 0.254: v51.7,28.25 49.7,28.25 IC1.2 | JP2.19 24.68,53.56 24.68,33.36 24.67,32.35 28.8,28.22 v28.83,28.22
  Bottom 0.254: v28.83,28.22 v51.69,28.24 v51.7,28.25
A2  (via drill 0.5)
  Top 0.254: v25.03,30 23.63,31.39 23.3,31.72 23.3,43.06 21.99,44.37 21.99,53.38 JP2.20 | v51.69,29.48 IC1.3
  Bottom 0.254: v25.03,30 26.29,29.99 26.68,29.99 29.49,29.99 29.95,29.5 51.58,29.5 v51.69,29.48
GND  (via drill 0.4, 0.5)
  Top 0.406: U$431.1 U$430.1 U$429.1 U$428.1 U$427.1 18.28,54.88 JP2.22
  other vias: 2,55.5 2,15 26,2 36,2 46,2 56,2 66,2 76,2 88,56 88,46 87.99,24 88,14 39.69,23.71 30.87,31.74 33.62,40.73 36.13,40.69 58.9,41.15 61.44,41.15 64.03,41.19 43.78,44.01 38.66,44.06 52.7,39.21 78.95,50.47 66.54,42.63 30.99,40.73
  pour Bottom: 5.8,71.63 92.64,71.77 93.22,-2.75 -2.56,-2.75 -2.91,54.46 -2.92,59.41 -2.88,71.57
  pour Top: -1.1,70.75 91.42,70.75 91.42,-1.1 -1.1,-1.1
GPA0  (via drill 0.5)
  Top 0.254: R5.1 25.9,12.6 25,11.7 S1.1 25,11.74 v24.07,12.67
  Bottom 0.254: v24.07,12.67 24.07,12.77 21,15.84 21.04,20.99 8.12,33.76 2.34,33.75 1.12,34.97 1.11,41.53 2.2,42.62 K1.1
GPA1  (via drill 0.5)
  Top 0.254: R6.1 44.14,11.02 43.33,10.21 40.04,10.21 S2.1 38.3,10.25 v37.55,11 | v1.11,31.97 1.12,43.05 1.12,43.13 1.12,43.7 2.29,44.86 5.44,44.86 6.56,43.74 K1.2
  Bottom 0.254: v37.55,11 23.39,11 19.55,14.86 19.55,20.17 | 19.55,20.17 19.55,20.19 19.55,20.17 | 19.55,20.17 8.52,31.17 1.91,31.17 v1.11,31.97
GPA3  (via drill 0.5)
  Top 0.254: R7.1 55.98,12.6 54.99,11.61 S3.1 55,11.67 v54.09,12.58
  Bottom 0.254: v54.09,12.58 54.09,15.09 52.48,16.7 31.3,16.7 29.84,18.16 29.84,20.49 28.03,22.3 22.05,22.3 19.5,24.85 19.45,24.89 8.05,36.28 2.82,36.29 1.93,37.18 1.93,39.1 2.92,40.09 3.72,40.09 K1.3
IO0.0  (via drill 0.5)
  Top 0.254: v59.1,30.34 59.08,30.35 58.66,30.77 IC1.4
  Bottom 0.254: JP2.2 69.13,53.58 70.35,52.36 70.35,31.45 66.84,27.94 61.51,27.93 v59.1,30.34
IO0.1  (via drill 0.5)
  Top 0.254: JP2.3 66.58,50.57 66.59,50.57 67.88,49.28 67.88,31.37 v66.41,29.9 | v60.91,31.38 v60.9,31.38 60.24,32.04 IC1.5
  Bottom 0.254: v66.41,29.9 62.38,29.9 v60.91,31.38
IO0.2
  Top 0.254: JP2.4 64.05,51.28 65.33,50 65.33,36.84 61.79,33.3 IC1.6
IO0.3
  Top 0.254: JP2.5 61.51,51.34 62.76,50.09 62.76,37.2 60.13,34.57 IC1.7
IO0.4
  Top 0.254: JP2.6 58.97,51.2 60.24,49.92 60.25,37.25 58.85,35.85 IC1.8
IO0.5
  Top 0.254: JP2.7 56.43,51.24 57.67,50 57.67,38.07 56.72,37.12 IC1.9
IO0.6
  Top 0.254: IC1.10 54.44,38.38 55.19,39.14 55.19,49.95 53.88,51.25 53.87,54.78 JP2.8
IO0.7
  Top 0.254: IC1.11 52.01,39.66 52.64,40.29 52.64,49.9 51.35,51.19 JP2.9
IO1.0
  Top 0.254: JP2.10 48.81,51.01 47.55,49.8 47.55,42.25 46.27,40.92 IC1.13
IO1.1  (via drill 0.5)
  Top 0.254: JP2.11 46.27,51.13 45,49.89 v45,42.55 | v44.51,39.66 IC1.14
  Bottom 0.254: v45,42.55 45.03,40.18 v44.51,39.66
IO1.2  (via drill 0.5)
  Top 0.254: JP2.12 43.73,51.1 42.55,49.92 42.55,43.21 v42.54,42.53 | v42.87,38.39 IC1.15
  Bottom 0.254: v42.54,42.53 42.54,38.81 v42.87,38.39
IO1.3
  Top 0.254: JP2.13 41.19,51.22 39.92,49.95 39.92,43.15 38.46,41.69 38.46,37.78 39.1,37.14 40.45,37.14 IC1.16
IO1.4
  Top 0.254: JP2.14 38.65,51.19 37.38,49.92 37.38,36.77 38.31,35.84 IC1.17
IO1.5
  Top 0.254: IC1.18 36.76,34.58 35.55,35.78 34.85,36.48 34.85,49.92 36.12,51.19 JP2.15
IO1.6
  Top 0.254: IC1.19 34.84,33.3 33.69,34.44 32.3,35.84 32.3,49.91 33.57,51.19 JP2.16
IO1.7
  Top 0.254: IC1.20 32.62,32.03 31.08,33.59 29.76,34.9 29.76,50 31.02,51.26 JP2.17
IO11  (via drill 0.5)
  Top 0.254: K1.12 15.65,29.92 R14.2 17.35,29.98 v20.18,29.98 | JP1.18 28.5,34.08 v29.24,33.34
  Bottom 0.254: v29.24,33.34 29.23,32.46 28.14,31.37 21.58,31.36 v20.18,29.98
IO14  (via drill 0.5)
  Top 0.254: K1.11 5.24,31.16 18.99,31.16 v19.76,31.93 21.19,30.5 21.19,28.89 20.08,27.77 R13.2 | v26.05,32.91 26.05,47.09 JP1.19
  Bottom 0.254: v19.76,31.93 20.74,32.91 v26.05,32.91
MOSI  (via drill 0.5)
  Top 0.254: K1.7 5.23,33.75 16.6,33.75 v16.94,34.07 16.27,34.75 R11.1
  Bottom 0.254: JP1.8 53.9,35.49 52.88,34.47 17.43,34.47 17.34,34.44 v16.94,34.07
N$1
  Top 0.305: JP1.1 71.68,43.59 C8.1
N$2
  Top 0.254: BZ1.- T1.3
N$3
  Top 0.254: IC2.7 37.98,18.43 36.2,16.63 R2.1
N$4
  Top 0.254: IC2.2 52.77,18.43 X2.1 54.17,21.88 C3.1
N$5
  Top 0.305: JP1.2 69.14,43.67 C8.2
N$6  (via drill 0.5)
  Top 0.305: C9.1 70.01,50.07 v69.33,50.07
  Bottom 0.305: v69.33,50.07 64.9,50.05 64.06,49.21 JP1.4
N$7
  Top 0.254: K5.1 69.14,16.33 R8.1
N$8
  Top 0.254: K6.2 R9.2
N$9  (via drill 0.5)
  Top 0.254: v67.64,52.38 80.39,52.38 80.99,51.78 R12.2
  Bottom 0.254: 37.34,51.63 34.54,51.63 33.58,50.67 33.58,50.08 | 37.34,51.63 39.61,51.63 | 39.61,51.63 42.06,51.63 | 42.06,51.63 44.59,51.63 | 44.59,51.63 47.19,51.63 | 47.19,51.63 49.78,51.63 | 33.58,50.08 JP1.16 | JP1.15 36.12,50.41 37.34,51.63 | JP1.14 38.66,50.68 39.61,51.63 | JP1.13 41.2,50.77 42.06,51.63 | JP1.12 43.74,50.78 44.59,51.63 | JP1.11 46.28,50.72 47.19,51.63 | JP1.10 48.82,50.67 49.78,51.63 | v67.64,52.38 62.27,52.38 61.51,51.63 49.79,51.63 49.78,51.63 | JP1.20 23.42,48.8 24.61,49.99 33.49,49.99 33.58,50.08
N$11
  Top 0.254: IC2.1 54.03,17.16 X2.2 54.13,17.26 C4.1
PWM  (via drill 0.5)
  Top 0.254: T1.1 R1.2 C7.1 16.86,23.75 16.86,24.16 16.86,24.21 16.12,24.95 v10.58,24.95 v10.57,24.96 | K1.4 5.37,38.86 3.03,38.87 2.08,37.92 2.08,29.6 2.08,29.53 v2.08,26.54
  Bottom 0.254: v2.08,26.54 2.98,25.56 3.58,24.96 v10.57,24.96
SCK  (via drill 0.5)
  Top 0.254: K1.10 17.73,32.46 17.87,32.46 18.94,33.53 v18.95,35.62 R10.2
  Bottom 0.254: JP1.9 51.36,36.91 50.29,35.84 19.17,35.84 v18.95,35.62
SCL  (via drill 0.5)
  Top 0.254: R3.1 36.47,19.2 36.98,19.7 IC2.6 44.59,19.7 45.25,20.37 45.25,28.84 44.59,29.5 IC1.22 32.26,29.49 28.42,25.66 23.35,25.66 22.39,26.62 22.38,26.63 21.86,27.14 v21.42,27.1
  Bottom 0.254: K1.5 4.11,37.66 5.23,38.82 9.73,38.83 v21.42,27.1
SDA  (via drill 0.5)
  Top 0.254: R4.1 36.25,21.77 37.05,20.98 IC2.5 43.84,20.98 44.43,21.56 44.43,27.58 43.79,28.22 IC1.23 40.47,28.22 32.78,28.22 28.59,24.04 22.46,24.04 21.9,24.61 21.77,24.74 v21.27,25.25
  Bottom 0.254: K1.6 8.87,37.55 v21.27,25.25
VBAT
  Top 0.305: IC2.3 50.8,19.7 51.47,20.38 51.47,23.98 52.25,24.76 64.53,24.76 | 64.53,24.76 76.56,24.76 83.93,17.36 BT1.+ | BT2.+ 64.52,24.77 64.53,24.76

### Text on the board
Top: Extentionskit V1.01
tDocu: +3V3 | GND | !INT | A2 | A1 | A0 | IO1.7 | IO1.6 | IO1.5 | IO1.4 | IO1.3 | IO1.2 | IO1.1 | IO1.0 | IO0.7 | IO0.6 | IO0.5 | IO0.4 | IO0.3 | IO0.2 | IO0.1 | IO0.0 | +3V3 | 40 | 21 | LCD | 1 | 20
bDocu: alternativ